# EAGLE design altimeter (EAGLE 9.2.2)
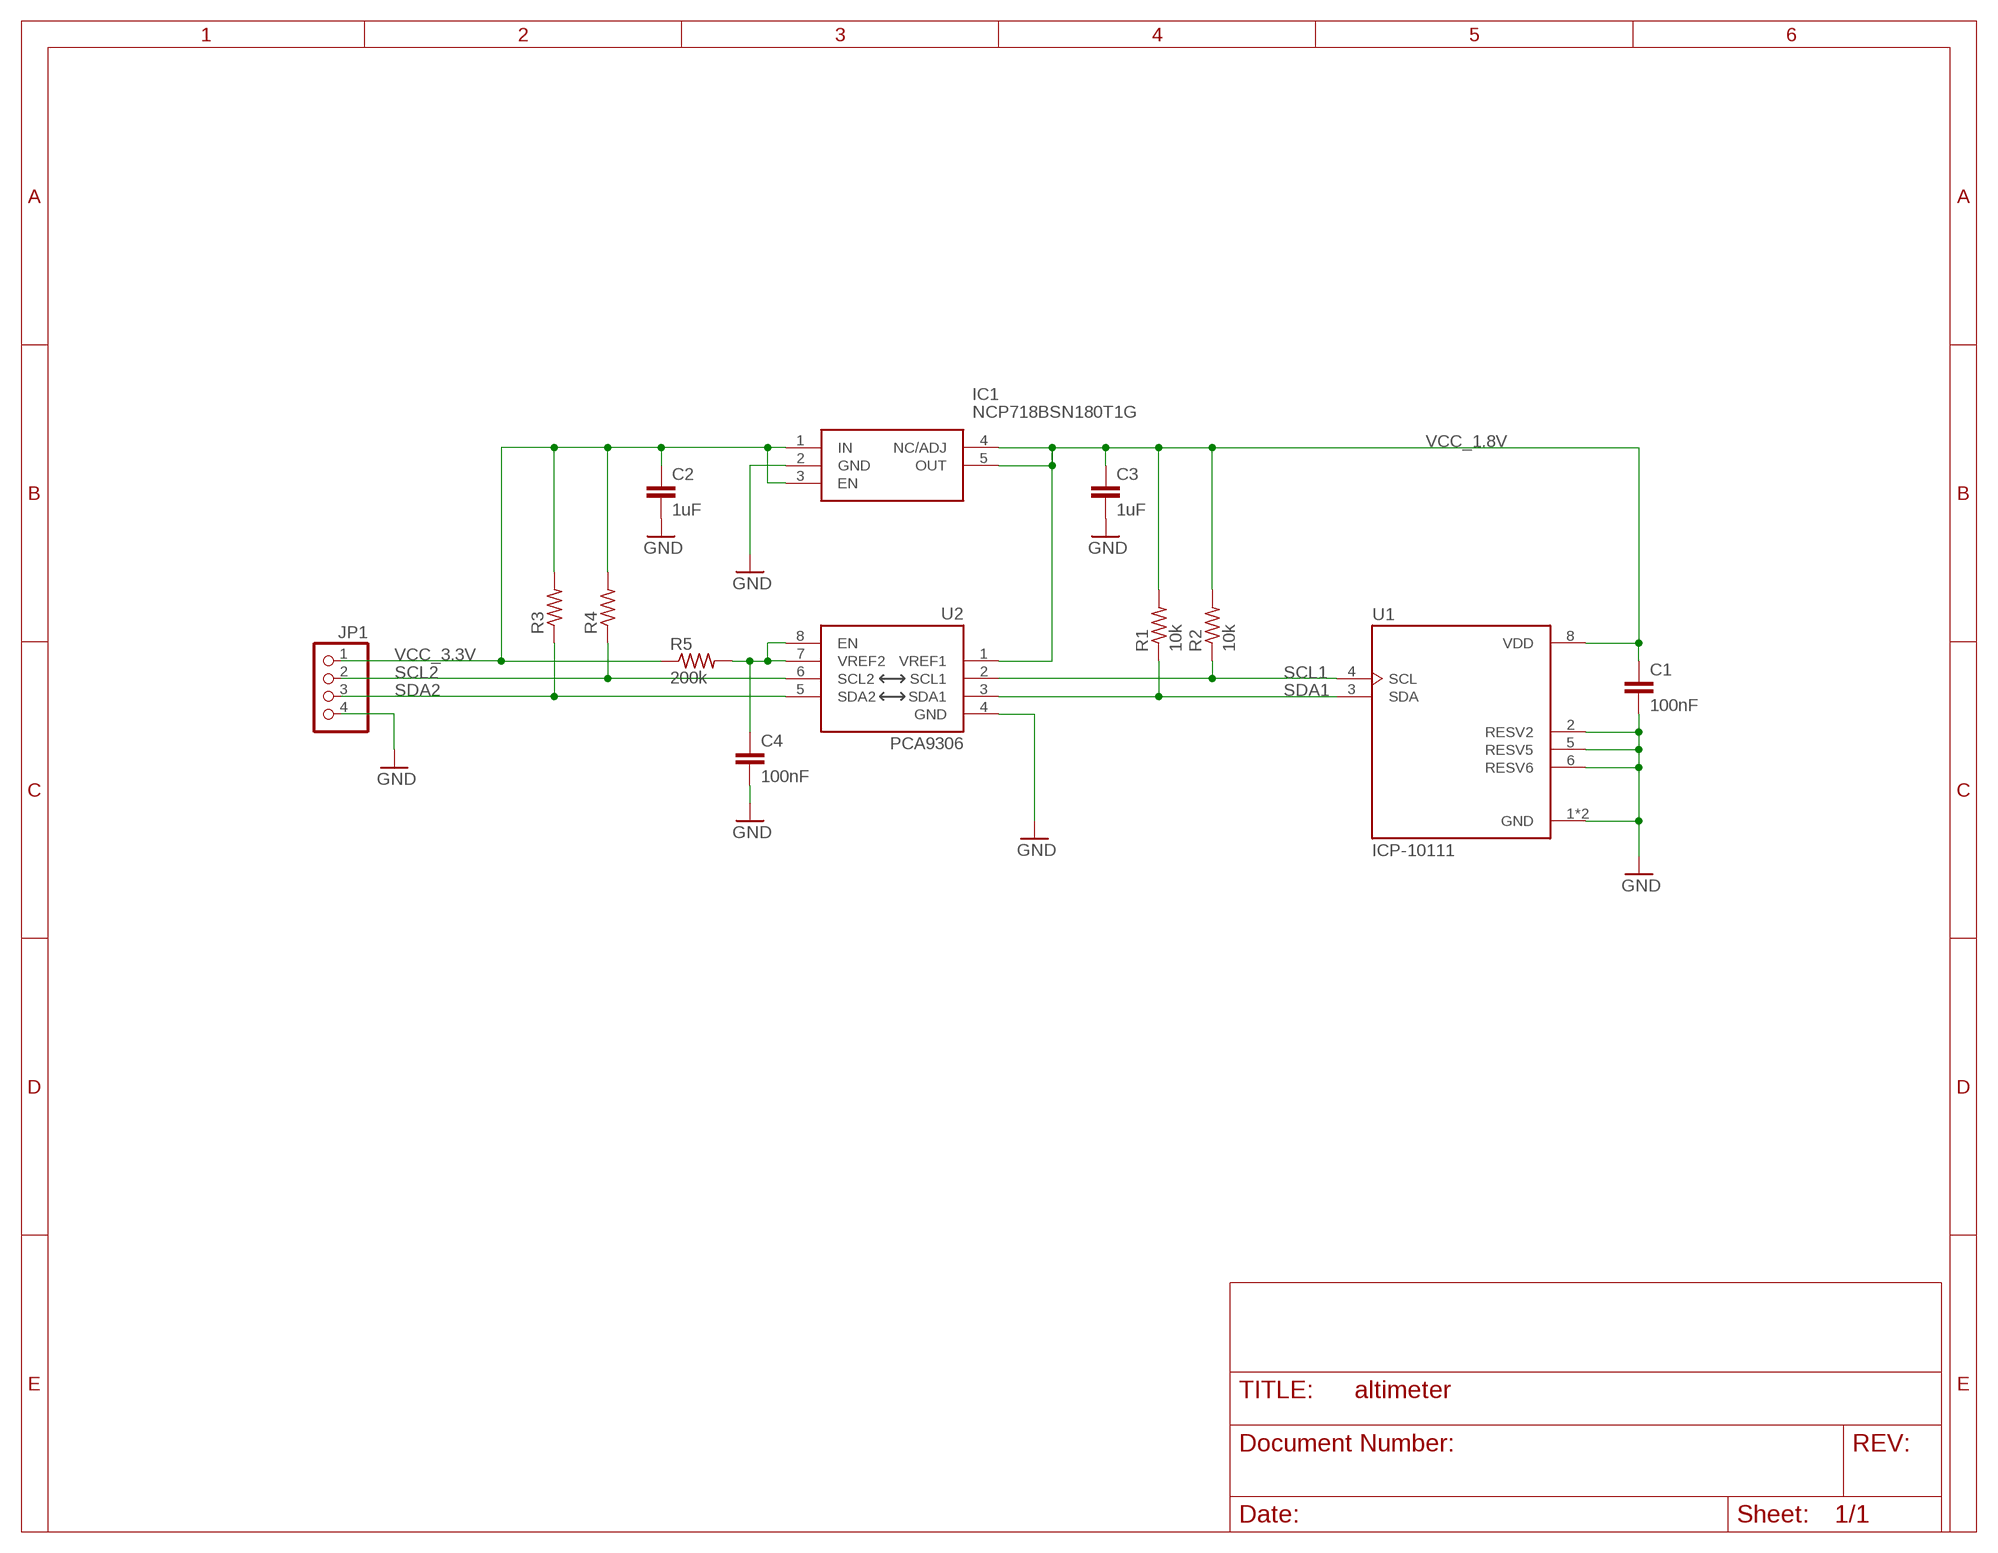
[diagram p0: schematic, sheet 1]

## Parts
C1  100nF  C-EUC0402  [C0402]
C2  1uF  C-EUC0402  [C0402]
C3  1uF  C-EUC0402  [C0402]
C4  100nF  C-EUC0402  [C0402]
IC1  NCP718BSN180T1G  [SOT95P280X100-5N]
JP1  PINHD-1X4  [1X04]
R1  10k  R-US_R0402  [R0402]
R2  10k  R-US_R0402  [R0402]
R3  R-US_R0402  [R0402]
R4  R-US_R0402  [R0402]
R5  200k  R-US_R0402  [R0402]
U1  ICP-10111  [PSON65P250X200X100-8N]
U2  PCA9306  PCA9306PCA9306DC-1:1  [PCA9306DC]

## Nets
GND: C1.2 C2.2 C3.2 C4.2 IC1.2(GND) JP1.4 U1.1(GND) U1.2(RESV2) U1.5(RESV5) U1.6(RESV6) U1.7(GND) U2.4(GND)
N$1: C4.1 R5.2 U2.7(VREF2) U2.8(EN)
SCL1: R2.1 U1.4(SCL) U2.2(SCL1)
SCL2: JP1.2 R4.1 U2.6(SCL2)
SDA1: R1.1 U1.3(SDA) U2.3(SDA1)
SDA2: JP1.3 R3.1 U2.5(SDA2)
VCC_1.8V: C1.1 C3.1 IC1.4(NC/ADJ) IC1.5(OUT) R1.2 R2.2 U1.8(VDD) U2.1(VREF1)
VCC_3.3V: C2.1 IC1.1(IN) IC1.3(EN) JP1.1 R3.2 R4.2 R5.1

## Library data of the parts
C1-C4 = rcl:C-EU: CAPACITOR, European symbol; SPICEPREFIX: C
IC1 = SamacSys_Parts:NCP718BSN180T1G: 300 MA LOW IQ, WIDE INPUT Source: Datasheet <https://componentsearchengine.com/Datasheets/1/NCP718BSN180T1G.pdf>; DESCRIPTION: 300 MA LOW IQ, WIDE INPUT; HEIGHT: 1mm; MANUFACTURER_NAME: ON Semiconductor; MANUFACTURER_PART_NUMBER: NCP718BSN180T1G; MOUSER_PART_NUMBER: 863-NCP718BSN180T1G
JP1 = pinhead:PINHD-1X4: PIN HEADER
R1-R5 = rcl:R-US_: RESISTOR, American symbol; SPICEPREFIX: R
U1 = ICP-10111:ICP-10111: 6-Axis Ois/Eis Optimized Mems Sensor; DIGI-KEY_PART_NUMBER: 1428-1145-1-ND; DIGI-KEY_PURCHASE_URL: https://www.digikey.com/product-detail/en/tdk-invensense/ICP-10111/1428-1145-1-ND/9555757?utm_source=snapeda&utm_medium=aggregator&utm_campaign=symbol; MF: TDK InvenSense; MP: ICP-10111; PACKAGE: PSON-8 TDK-InvenSense
U2 = SparkFun-IC-Comms:PCA9306: Bidirectional I2C level shifter Not compatible with all available part number pinout schemes- DOUBLE CHECK!!! Datasheet <https://cdn.sparkfun.com/datasheets/BreakoutBoards/PCA9306DC.pdf> SparkFun Products SparkFun Inventor's Kit for RedBot <https://www.sparkfun.com/products/12649> (ROB-12649) SparkFun RedBot Basic Kit <https://www.sparkfun.com/products/13166> (ROB-13166) SparkFun Level Translator Breakout - PCA9306 <https://www.sparkfun.com/products/11955> (BOB-11955) SparkFun Block for Intel Edison - ADC <https://www.sparkfun.com/products/13770> (DEV-13770) SparkFun Block for Intel® Edison - Raspberry Pi B <https://www.sparkfun.com/products/13044> (DEV-13044) SparkFun RedBot Sensor - Accelerometer <https://www.sparkfun.com/products/12589> (SEN-12589); PROD_ID: IC-10023

## Net classes
0 default: width 0.203 mm

## Board
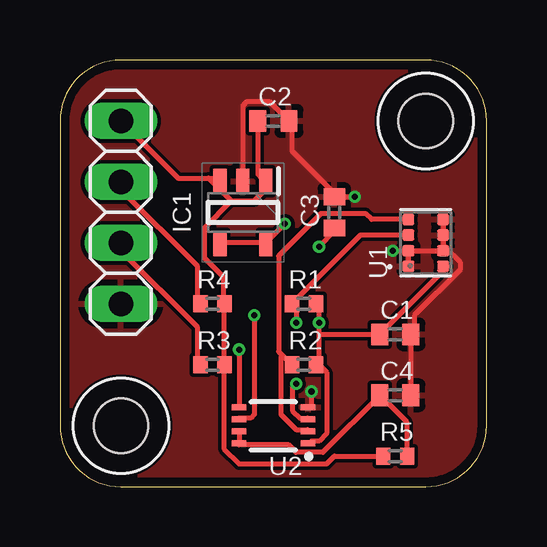
[diagram p1: board, top side]
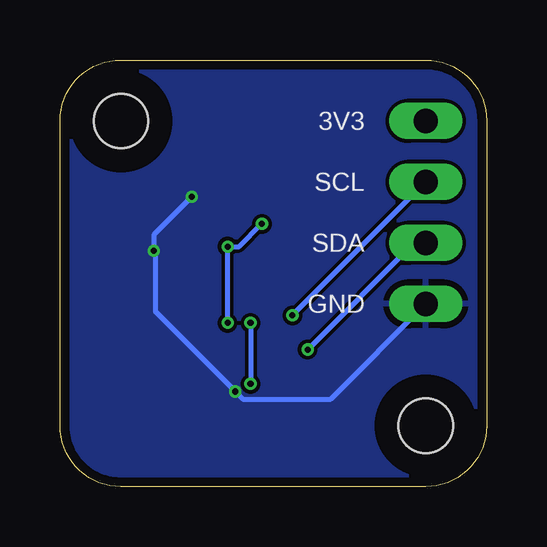
[diagram p2: board, bottom side, seen from below]

Size 17.78 x 17.78 mm. Coordinates in mm from the lower left corner, seen from the top.
Outline: 2.54,0 15.24,0 arc90 17.78,2.54 17.78,15.24 arc90 15.24,17.78 2.54,17.78 arc90 0,15.24 0,2.54 arc90 2.54,0
Copper layers (1*16): Top 0.035559375mm / dielectric 1.6mm / Bottom 0.035559375mm
Design rules "oshpark-2layer": minimum track width 6mil, minimum drill 10mil, track to track 6mil, track to pad 6mil, pad to pad 6mil, via to via 6mil, smd to smd 6mil, copper to edge 15mil, drill to drill 6mil, minimum pad ring 5mil, minimum via ring 5mil, stop-mask expansion 2.5mil, vias tented up to drill 0mil, thermal gap 10mil

### Footprints (pad centres in the part's own frame; a part is rotated, then mirrored left to right if it is on the bottom)
C0402 = smd 0.7 x 0.9: 1 -0.65,0; 2 0.65,0
SOT95P280X100-5N = smd 1.05 x 0.55: 1 -1.3,0.95; 2 -1.3,0; 3 -1.3,-0.95; 4 1.3,-0.95; 5 1.3,0.95
1X04 = drill 1.016 long: 1 -3.81,0; 2 -1.27,0; 3 1.27,0; 4 3.81,0
R0402 = smd 0.6 x 0.7: 1 -0.5,0; 2 0.5,0
PSON65P250X200X100-8N = smd 0.46 x 0.49: 1 -0.975,0.72; 2 -0.325,0.72; 3 0.325,0.72; 4 0.975,0.72; 5 0.975,-0.72; 6 0.325,-0.72; 7 -0.325,-0.72; 8 -0.975,-0.72
PCA9306DC = smd 0.25 x 0.602: 1 -0.73,-1.446; 2 -0.23,-1.446; 3 0.27,-1.446; 4 0.77,-1.446; 5 0.77,1.431; 6 0.27,1.431; 7 -0.23,1.431; 8 -0.73,1.431
#2 = hole 2.261: 0,0

### Placement (x,y rotation side)
C1  13.97,6.35 0 top
C2  8.89,15.24 0 top
C3  11.43,11.43 90 top
C4  13.97,3.81 0 top
IC1  7.62,11.43 270 top
JP1  2.54,11.43 270 top
R1  10.16,7.62 0 top
R2  10.16,5.08 0 top
R3  6.35,5.08 0 top
R4  6.35,7.62 0 top
R5  13.97,1.27 0 top
U1  15.24,10.16 90 top
U2  8.89,2.54 90 top
U$1  [#2]  2.54,2.54 0 top
U$2  [#2]  15.24,15.24 0 top

### Tracks (layer width: path | path; a pad name or v marks a point on that pad's centre or on a via)
GND  (via drill 0.25)
  Top 0.203: U1.2 U1.1 | U1.7 U1.6 U1.5 | U1.2 U1.7 | v12.29,12.08 C3.2 11.43,12.22 9.68,13.97 9.68,15.24 C2.2 9.53,15.24 8.73,16.03 7.78,16.03 7.62,15.88 IC1.2 | v13.87,9.84 U1.2 | C4.2 14.61,3.81 14.61,6.35 C1.2 14.76,6.35 14.76,7.14 16.67,9.05 16.67,9.37 16.03,10 U1.7 | v10.48,3.97 10.48,3.33 U2.4
  Bottom 0.203: v12.29,12.08 13.87,10.5 v13.87,9.84 13.81,9.68 13.81,7.3 v10.48,3.97 10.16,3.65 6.51,3.65 JP1.4
  pour Top (isolate 0.152): 0,17.78 17.78,17.78 17.78,0 0,0
  pour Bottom (isolate 0.152): 0,17.78 17.78,17.78 17.78,0 0,0
N$1
  Top 0.203: U2.7 7.46,2.22 7.46,1.91 U2.8 7.46,1.75 9.53,1.75 9.84,1.43 10.95,1.43 13.34,3.81 | 13.34,3.81 14.45,2.7 14.45,1.27 R5.2 | 13.34,3.81 C4.1
SCL1
  Top 0.203: U1.4 12.98,11.13 12.73,11.38 10.88,11.38 9.11,9.62 9.11,5.63 9.28,5.46 | 9.28,5.46 R2.1 | U2.2 10.32,2.38 9.84,2.38 9.21,3.02 9.21,5.4 9.28,5.46
SCL2  (via drill 0.25)
  Top 0.203: v8.1,7.14 8.1,3.02 7.94,2.86 7.46,2.86 U2.6 | JP1.2 2.54,12.38 5.71,9.21 5.71,7.62 R4.1
  Bottom 0.203: JP1.2 v8.1,7.14
SDA1  (via drill 0.25)
  Top 0.203: U1.3 12.52,10.48 R1.1 9.84,7.78 v9.84,6.83 | v9.84,4.29 9.68,4.13 9.68,3.17 10,2.86 10.32,2.86 U2.3
  Bottom 0.203: v9.84,6.83 v9.84,4.29
SDA2  (via drill 0.25)
  Top 0.203: v7.46,5.71 7.46,3.33 U2.5 | JP1.3 2.54,9.84 5.71,6.67 5.71,5.08 R3.1
  Bottom 0.203: v7.46,5.71 3.02,10.16 JP1.3
VCC_1.8V  (via drill 0.25)
  Top 0.203: U1.8 16.16,9.19 C1.1 10.79,6.35 | IC1.4 6.83,10.16 8.41,10.16 IC1.5 8.57,10.16 v9.37,10.95 | 10.79,5.08 11.11,4.76 11.11,2.22 10.79,1.91 10.48,1.91 U2.1 | 10.79,5.08 10.79,6.35 | 10.79,6.35 v10.79,6.83 10.79,7.62 R1.2 | 10.79,5.08 R2.2 | v10.79,10 11.43,10.64 C3.1
  Bottom 0.203: v10.79,6.83 v10.79,10 10.32,10 v9.37,10.95
VCC_3.3V
  Top 0.203: C2.1 8.26,15.24 8.26,13.02 8.41,12.86 IC1.1 8.41,12.7 8.41,12.22 8.1,11.91 7.14,11.91 | 6.19,12.86 4.92,12.86 JP1.1 | 6.19,12.86 6.67,12.86 IC1.3 | 6.19,12.86 7.14,11.91 | 6.83,7.62 6.83,5.08 | R5.1 11.43,1.27 11.11,0.95 7.46,0.95 6.83,1.59 6.83,5.08 | 6.83,5.08 R3.2 | 7.14,11.91 6.03,10.79 6.03,9.53 6.83,8.73 6.83,7.62 | 6.83,7.62 R4.2

### Text on the board
bNames: 3V3 | SCL | SDA | GND